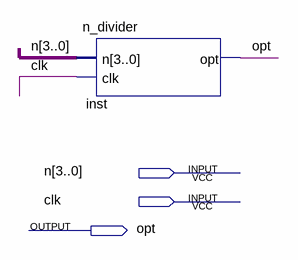
[diagram p0: schematic sheet]
// Quartus schematic test.bdf as structural Verilog: 1 symbols, 3 pins
module test (
  input  [3:0] n,
  input  clk,
  output opt
);

  n_divider inst (.n(n), .clk(clk), .opt(opt));
endmodule
